# Altium schematic sheet USB_Serial.SchDoc
size 420 x 297 mm; Organization: ORGANIZATION; Address1: ADDRESS 1; Address2: ADDRESS 2; Address3: ADDRESS 3; Address4: ADDRESS 4; Revision: -; SheetNumber: 3; SheetTotal: 6; ENG_APP_DATE: --/--/--; DSN_APP_DATE: --/--/--; CHK_APP_DATE: --/--/--; Sheet_Text_ProjectName: ApolloEcho_Dev_Kit; Sheet_Text_Author: mtnguyen; Sheet_Text_Title: USB_Serial; Sheet_Text_Rev: 2.0.0; Sheet_Text_Date: Mar 01, 25
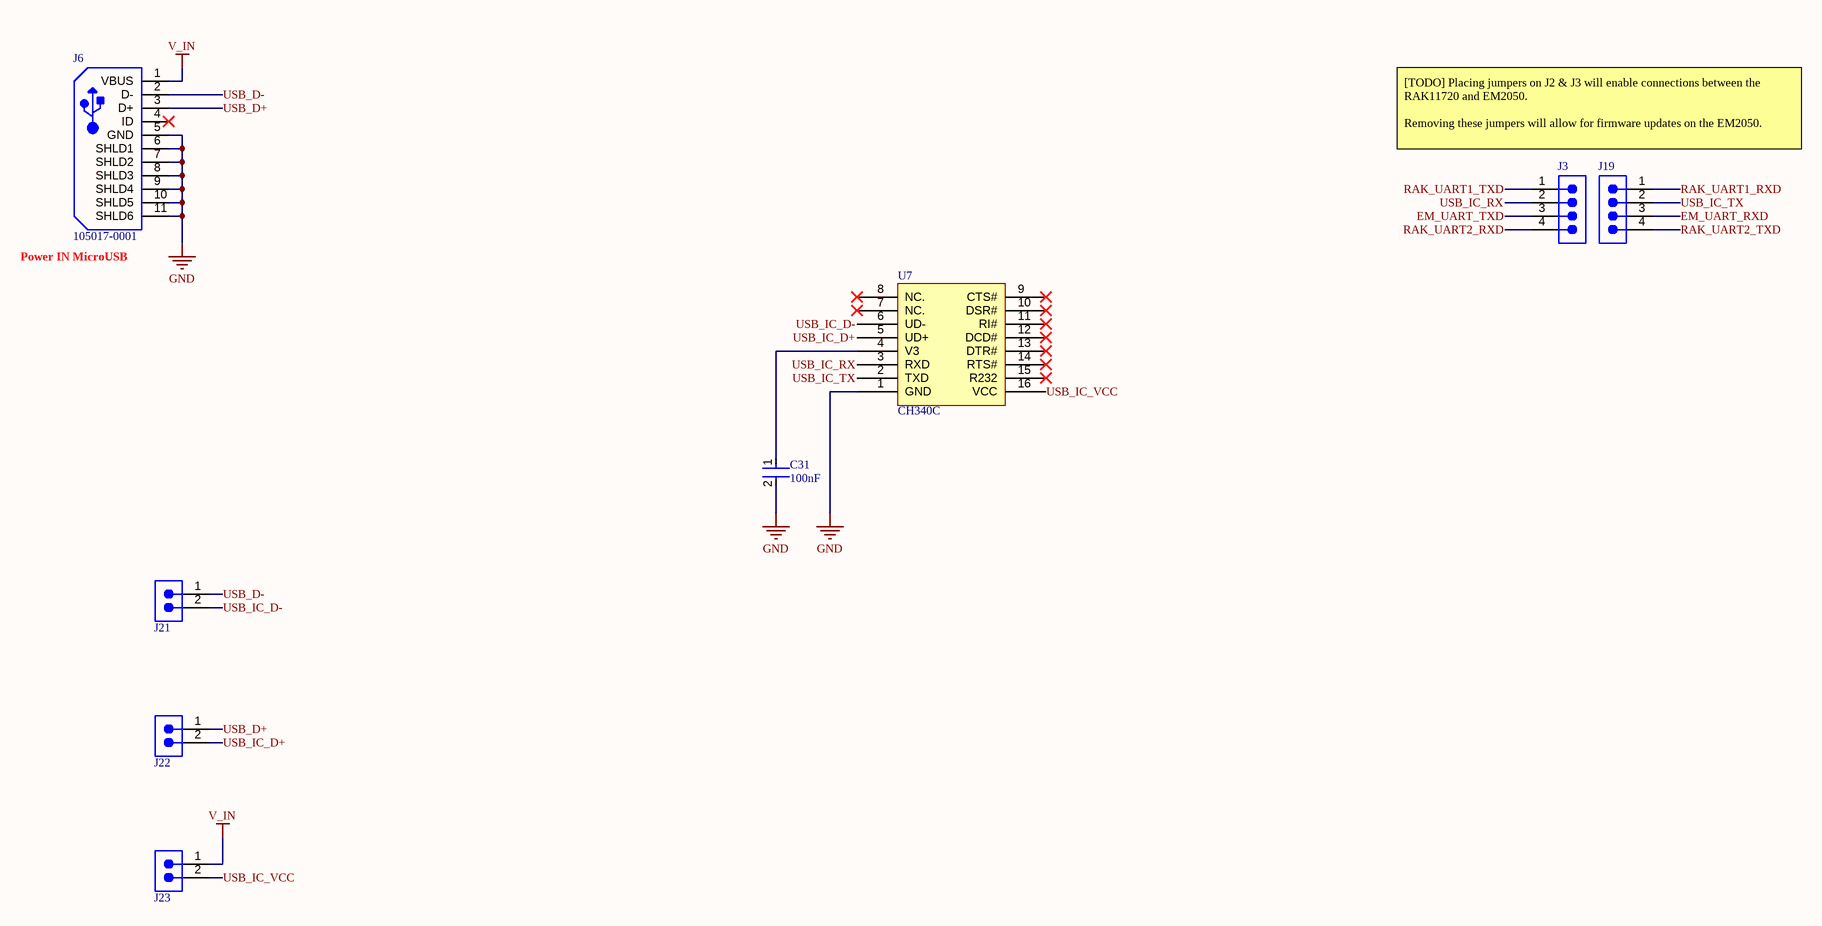
[diagram p0: USB_Serial.SchDoc]

## Parts
C31  Capacitance: 100nF  [FP-0402-L_1_0_1-W_0_5_0_1-IPC_C]  (hidden comment: 0402ZD104KAT2A)
J3  61300411121  [61300411121]  (value not drawn)
J6  105017-0001  [USB-MICRO-B_V]
J19  61300411121  [61300411121]  (value not drawn)
J21  61300211121  [61300211121]  (value not drawn)
J22  61300211121  [61300211121]  (value not drawn)
J23  61300211121  [61300211121]  (value not drawn)
U7  CH340C  [CH340C]

## Nets
GND: C31.2 J6.5(GND) J6.6(SHLD1) J6.7(SHLD2) J6.8(SHLD3) J6.9(SHLD4) J6.10(SHLD5) J6.11(SHLD6) U7.1(GND)
V_IN: J6.1(VBUS) J23.1
EM_UART_RXD: J19.3
EM_UART_TXD: J3.3
RAK_UART1_RXD: J19.1
RAK_UART1_TXD: J3.1
RAK_UART2_RXD: J3.4
RAK_UART2_TXD: J19.4
USB_D+: J6.3(D+) J22.1
USB_D-: J6.2(D-) J21.1
USB_IC_D+: J22.2 U7.5(UD+)
USB_IC_D-: J21.2 U7.6(UD-)
USB_IC_RX: J3.2 U7.3(RXD)
USB_IC_TX: J19.2 U7.2(TXD)
USB_IC_VCC: J23.2 U7.16(VCC)
NetC31_1: C31.1 U7.4(V3)

Not connected (* = marked no-connect by the designer): J6 4(ID)*; U7 7(NC.)* 8(NC.)* 9(CTS#)* 10(DSR#)* 11(RI#)* 12(DCD#)* 13(DTR#)* 14(RTS#)* 15(R232)*

## Notes on the sheet
- [TODO] Placing jumpers on J2 & J3 will enable connections between the RAK11720 and EM2050.
  Removing these jumpers will allow for firmware updates on the EM2050.
- (near J6) Power IN MicroUSB
- THIS DOCUMENT AND THE DATA DISCLOSED HEREIN OR
- HEREWITH IS THE PROPERTY OF ALTIUM LIMITED AND MAY
- BE FREELY DISTRIBUTED IN WHOLE. NO RIGHTS ARE
- RESERVED OR EXPRESS OR IMPLIED WARANTEE GIVEN.
- PROJECT NAME
- TITLE
- AUTHOR
- Rev.
- FILE NAME
- Date
- SHEET
- OF

## Library data of the parts
C31 = CMP-2008-02878-3: General Purpose Ceramic Capacitor, 0402, 100nF, 10%, X5R, 15%, 10V; Dissipation Factor: 5%; Insulation Resistance: 100GR; Case/Package: 0402; Termination: SMD/SMT; Thickness: 0.022inch; Packaging: Tape and Reel; REACH SVHC: No SVHC; Case Code (Imperial): 0402; Width: 0.02inch; Series: -; Construction: Flat; Dielectric: X5R; Voltage: 10V; Height: 0.56mm; Voltage Rating (DC): 10V; Depth: 0.5mm; Tolerance: 10%; Radiation Hardening: No; Voltage Rating: 10V; Package Quantity: 1; Contact Plating: Tin; RoHS Compliant: Yes; Case Code (Metric): 1005; Lead Free: Lead Free; Max Operating Temperature: 85°C; Length: 1mm; Min Operating Temperature: -55°C; Mount: Surface Mount
J3 J19 = CMP-1502-01064-3: NexarPartId: 32855522; Operating Supply Voltage: 250V; Pitch: 2.54mm; Contact Resistance: 20mΩ; Number of Positions: 4; Current Rating: 3A; Connector Type: Male Pin; Gender: Male; Contact Plating: Gold; Height: 8.89mm; Lead Pitch: 2.54mm; Lead Free: Lead Free; Contact Mating Length: 5.9944mm; Number of Rows: 1; Termination: Solder; Packaging: Bulk; REACH SVHC: Unknown; Min Operating Temperature: -40°C; RoHS: Compliant; Number of Contacts: 4; Voltage Rating: 250V; Color: Black; Max Operating Temperature: 105°C; Contact Material: Copper; Mount: Through Hole; Orientation: Vertical; Number of Pins: 4
J6 = CMP-2000-05827-1: Micro-USB B Receptacle, Right Angle, Bottom Mount, Surface Mount, with Solder Tabs, -30 to 85 degC, 5-Pin USB, RoHS, Tape and Reel; Manufacturer: Molex; Featured Product: Micro-USBConnectorsUSBConnectors; Other Names: WM1399DKR; Package Version: Rev. F, 12/2012; Number of Contacts: 5; Connector Type: USB-microB; Catalog Drawings: 1050170001; 3D Model: 105017-0001.stp; Mating Products: WM17145-ND-CABLEMICROUSBBTOSTDA1.0MWM17147-ND-CABLEMICROUSBBTOSTDA2.0MWM17146-ND-CABLEMICROUSBBTOSTDA1.5M; PCN Assembly/Origin: ResinSupplier21/Oct/2015; Voltage - Max: 30V; Online Catalog: Molex-MicroUSB; Manufacturer URL: http://www.molex.com/; Package Description: 5-Leads USB, Micro B, Body 7.5 x 5 mm, Pitch 0.65 mm; Datasheet URL: http://www.molex.com/elqNow/elqRedir.htm?ref=http://www.molex.com/webdocs/datasheets/pdf/en-us/1050170001_IO_CONNECTORS.pdf; Ingress Protection: -; Datasheet Version: 03/2016; Mounting Type: BoardCutout,SurfaceMount,RightAngle; Circuits: 5; Standard Package: 1; Package Reference: MICRO-B; Package URL: http://www.molex.com/pdm_docs/sd/1050170001_sd.pdf; Category: Connectors,Interconnects; Series: -; RoHS Information: 1050170001CertofCompliance; Features: Shielded,SolderRetention; Family: USB,DVI,HDMIConnectors; Specifications: -; Gender: Receptacle; Packaging: Digi-Reel®; Mounting Technology: SurfaceMount
J21-J23 = CMP-1712-00002-6: NexarPartId: 20081794; Number of Contacts: 2; Pitch: 2.54mm; Connector Type: Male Pin; Voltage Rating: 250V; Current Rating: 3A; Gender: Male; Contact Resistance: 20mΩ; Height: 8.94mm; Lead Free: Lead Free; Number of Pins: 2; Termination: Through Hole; RoHS: Compliant; Lead Pitch: 2.54mm; REACH SVHC: No SVHC; Housing Material: PBT; Contact Mating Length: 5.9944mm; Min Operating Temperature: -40°C; Orientation: Vertical; Contact Material: Copper; Contact Gender: Male; Max Operating Temperature: 125°C; Number of Rows: 1; Number of Positions: 2; Packaging: Bulk; Contact Plating: Gold; Mount: Through Hole; Color: Black; Operating Supply Voltage: 250V
U7 = CH340C: USB to Serial CH340 IC